# Altium schematic sheet BT.SchDoc
size A4
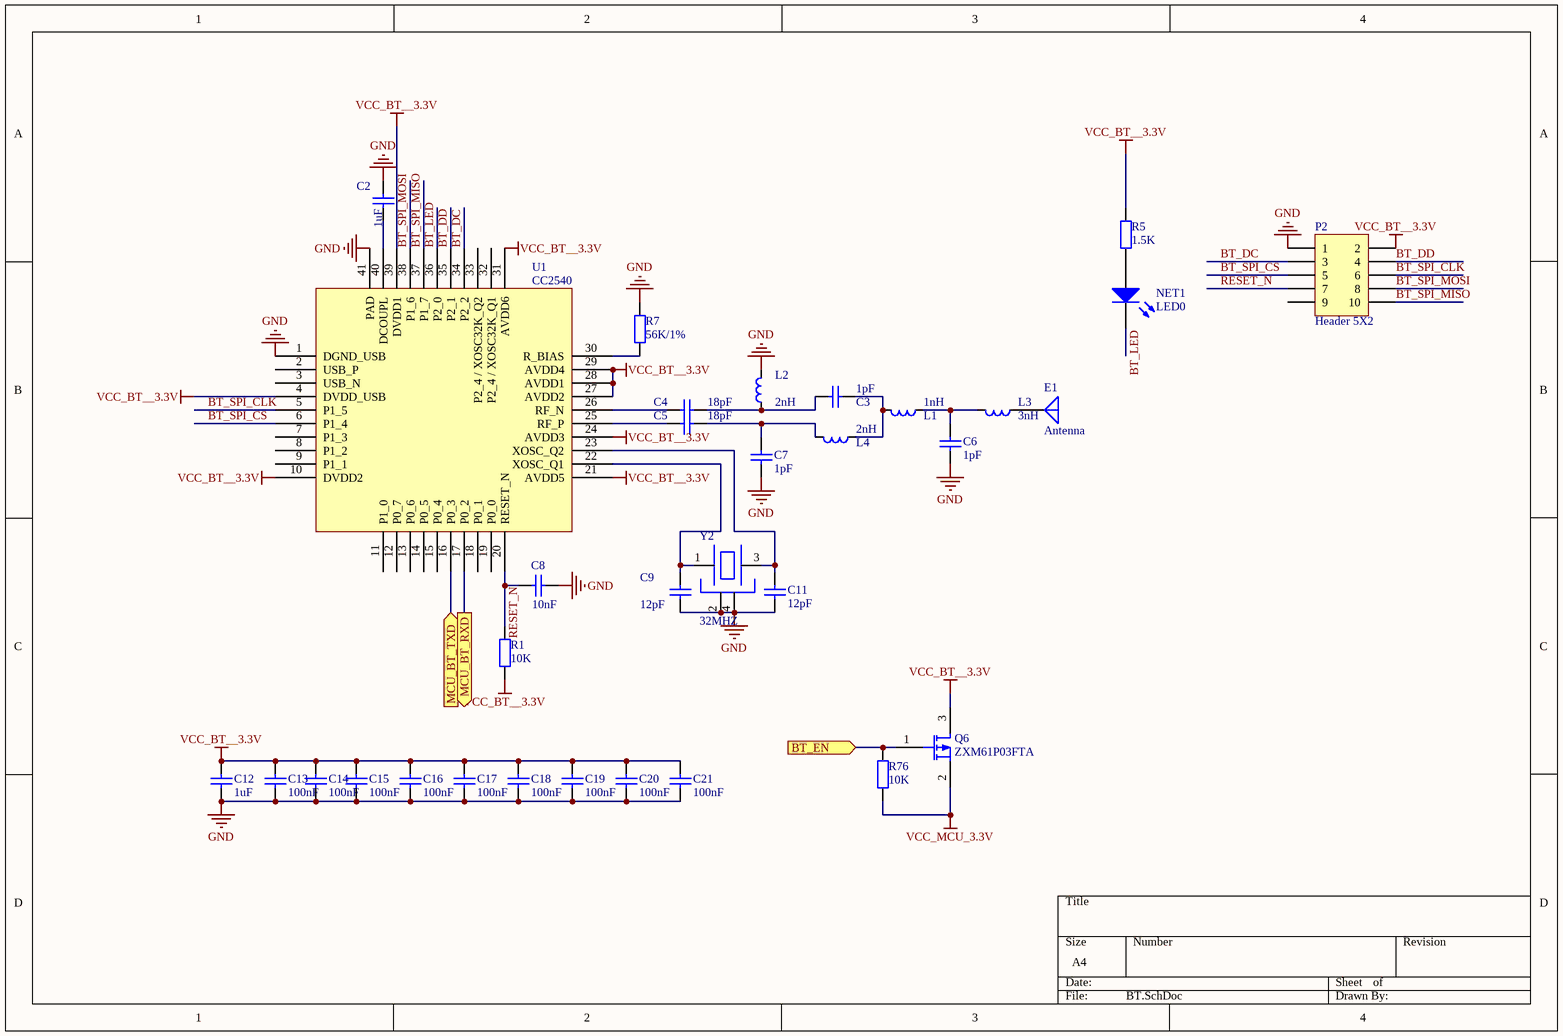
[diagram p0: BT.SchDoc]

## Parts
C2  1uF  [0603C]
C3  1pF  [0402C]
C4  18pF  [0402C]
C5  18pF  [0402C]
C6  1pF  [0402C]
C7  1pF  [0402C]
C8  10nF  [0402C]
C9  12pF  [0402C]
C11  12pF  [0402C]
C12  1uF  [0603C]
C13  100nF  [0603C]
C14  100nF  [0603C]
C15  100nF  [0603C]
C16  100nF  [0603C]
C17  100nF  [0603C]
C18  100nF  [0603C]
C19  100nF  [0603C]
C20  100nF  [0603C]
C21  100nF  [0603C]
E1  Antenna  [AN2051]
L1  1nH  [0402R]
L2  2nH  [0402R]
L3  3nH  [0402R]
L4  2nH  [0402R]
NET1  LED0  [0603LED]
P2  Header 5X2  [HDR2X5]
Q6  ZXM61P03FTA  [SOT23-3]
R1  10K  [0603R]
R5  1.5K  [0603R]
R7  56K/1%  [0603R]
R76  10K  [0603R]
U1  CC2540  [QFN50P600X600X80-40N]
Y2  32MHZ  [OSCILLATOR-3.2X2.5]

## Ports
BT_EN (in), MCU_BT_RXD (out), MCU_BT_TXD (in)

## Nets
GND: C2.1 C6.1 C7.1 C8.1 C9.1 C11.1 C12.2 C13.2 C14.2 C15.2 C16.2 C17.2 C18.2 C19.2 C20.2 C21.2 L2.2 P2.1 R7.1 U1.1(DGND_USB) U1.41(PAD) Y2.2(GND) Y2.4(GND)
VCC_BT__3.3V: C12.1 C13.1 C14.1 C15.1 C16.1 C17.1 C18.1 C19.1 C20.1 C21.1 P2.2 Q6.3(S) R1.2 R5.1 U1.4(DVDD_USB) U1.10(DVDD2) U1.21(AVDD5) U1.24(AVDD3) U1.27(AVDD2) U1.28(AVDD1) U1.29(AVDD4) U1.31(AVDD6) U1.39(DVDD1)
VCC_MCU_3.3V: Q6.2(D) R76.2
BT_DC: P2.3 U1.34(P2_2)
BT_DD: P2.4 U1.35(P2_1)
BT_EN: Q6.1(G) R76.1 ; port BT_EN
BT_LED: NET1.2(K) U1.36(P2_0)
BT_SPI_CLK: P2.6 U1.5(P1_5)
BT_SPI_CS: P2.5 U1.6(P1_4)
BT_SPI_MISO: P2.10 U1.37(P1_7)
BT_SPI_MOSI: P2.8 U1.38(P1_6)
MCU_BT_RXD: U1.17(P0_2) ; port MCU_BT_RXD
MCU_BT_TXD: U1.16(P0_3) ; port MCU_BT_TXD
RESET_N: C8.2 P2.7 R1.1 U1.20(RESET_N)
NetC2_2: C2.2 U1.40(DCOUPL)
NetC3_1: C3.1 C4.2 L2.1
NetC3_2: C3.2 L1.2 L4.1
NetC4_1: C4.1 U1.26(RF_N)
NetC5_1: C5.1 U1.25(RF_P)
NetC5_2: C5.2 C7.2 L4.2
NetC6_2: C6.2 L1.1 L3.2
NetC9_2: C9.2 U1.22(XOSC_Q1) Y2.1
NetC11_2: C11.2 U1.23(XOSC_Q2) Y2.3
NetE1_1: E1.1(A) L3.1
NetNET1_1: NET1.1(A) R5.2
NetR7_2: R7.2 U1.30(R_BIAS)

Not connected (* = marked no-connect by the designer): P2 9; U1 2(USB_P) 3(USB_N) 7(P1_3) 8(P1_2) 9(P1_1) 11(P1_0) 12(P0_7) 13(P0_6) 14(P0_5) 15(P0_4) 18(P0_1) 19(P0_0) 32(P2_4_/_XOSC32K_Q1) 33(P2_4_/_XOSC32K_Q2)

## Library data of the parts
C2-C9 C11-C21 = Cap: Capacitor; Value: 0.1uF/10V; Published: 8-Jun-2000; LatestRevisionDate: 17-Jul-2002; LatestRevisionNote: Re-released for DXP Platform.; PackageReference: RAD-0.3; Publisher: Altium Limited
E1 = Antenna: Generic Antenna; Published: 24-Mar-1999; LatestRevisionDate: 17-Jul-2002; LatestRevisionNote: Re-released for DXP Platform.; PackageReference: PIN1; Publisher: Altium Limited
L1-L4 = L_4: L; Part Field 1: VLF3014AT-2R2M1R2
NET1 = LED0: Typical INFRARED GaAs LED; Published: 8-Jun-2000; LatestRevisionDate: 08-Jul-2005; LatestRevisionNote: Mech Layer 1 removed.; PackageReference: LED-0; Publisher: Altium Limited
P2 = Header 5X2: Header, 5-Pin, Dual row; LatestRevisionDate: 17-Jul-2002; LatestRevisionNote: Re-released for DXP Platform.; Publisher: Altium Limited
Q6 = MOSFET-P: ZXM61P03F; Published: 8-Jun-2000; LatestRevisionDate: 17-Jul-2002; LatestRevisionNote: Re-released for DXP Platform.; PackageVersion: 1995/1996; PackageReference: E3; Publisher: Altium Limited
R1 R5 R7 R76 = Res2: Resistor; Value: 1K; Published: 8-Jun-2000; LatestRevisionDate: 17-Jul-2002; LatestRevisionNote: Re-released for DXP Platform.; PackageReference: AXIAL-0.4; Publisher: Altium Limited
Y2 = XTAL3